# Altium project PCB_Project1.PrjPCB
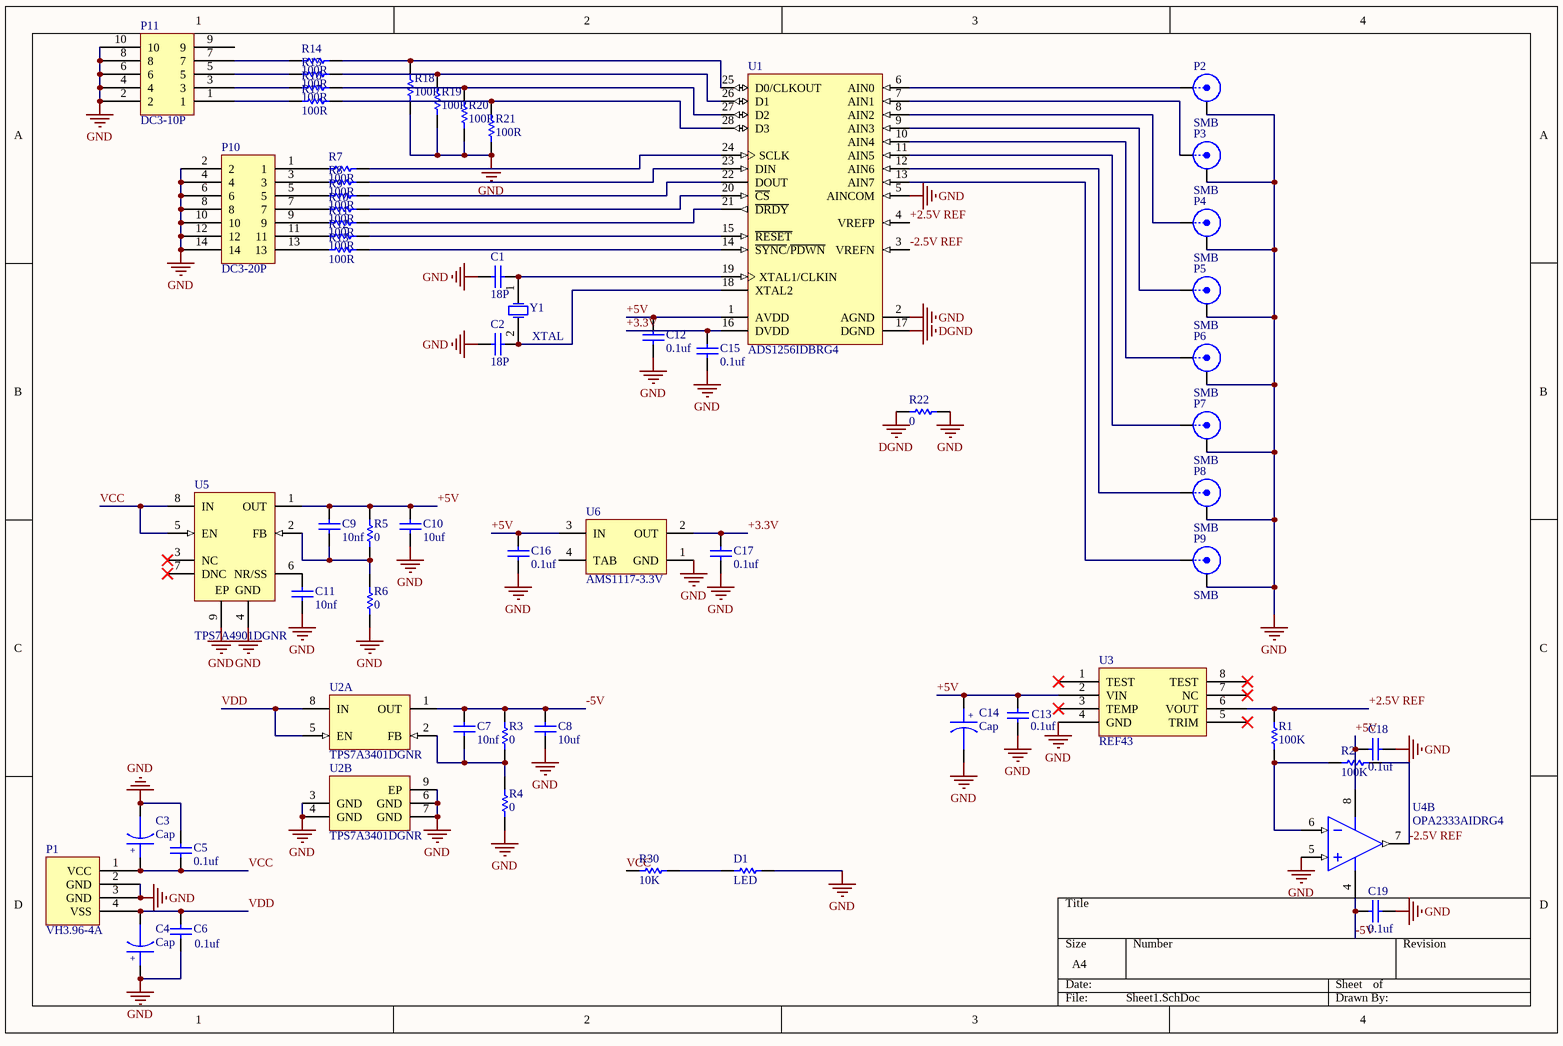
[diagram p0: Sheet1.SchDoc]
1 sheet, 61 parts. Net scope: global (net labels, ports and power ports of the same name join across sheets).
Board file: PCB1.PcbDoc

## Sheet Sheet1.SchDoc
size A4

### Parts
C1  18P  [0603C]
C2  18P  [0603C]
C3  Cap  [7343C-TYPE_D]
C4  Cap  [7343C-TYPE_D]
C5  0.1uf  [0805]
C6  0.1uf  [0805]
C7  10nf  [0805]
C8  10uf  [0805]
C9  10nf  [0805]
C10  10uf  [0805]
C11  10nf  [0805]
C12  0.1uf  [0805]
C13  0.1uf  [0805]
C14  Cap  [3216C-TYPE_A]
C15  0.1uf  [0805]
C16  0.1uf  [0805]
C17  0.1uf  [0805]
C18  0.1uf  [3216C-TYPE_A]
C19  0.1uf  [3216C-TYPE_A]
D1  LED  [0805]
P1  VH3.96-4A  [VH3.96-4P]
P2  SMB  [SMB_V-RJ45]
P3  SMB  [SMB_V-RJ45]
P4  SMB  [SMB_V-RJ45]
P5  SMB  [SMB_V-RJ45]
P6  SMB  [SMB_V-RJ45]
P7  SMB  [SMB_V-RJ45]
P8  SMB  [SMB_V-RJ45]
P9  SMB  [SMB_V-RJ45]
P10  DC3-20P  [DC3-14P]
P11  DC3-10P  [DC3-10P]
R1  100K  [0805]
R2  100K  [0805]
R3  0  [0805]
R4  0  [0805]
R5  0  [0805]
R6  0  [0805]
R7  100R  [0805]
R8  100R  [0805]
R9  100R  [0805]
R10  100R  [0805]
R11  100R  [0805]
R12  100R  [0805]
R13  100R  [0805]
R14  100R  [0805]
R15  100R  [0805]
R16  100R  [0805]
R17  100R  [0805]
R18  100R  [0805]
R19  100R  [0805]
R20  100R  [0805]
R21  100R  [0805]
R22  0  [0805]
R30  10K  [0805]
U1  ADS1256IDBRG4  [TI-DB28_N]
U2  TPS7A3401DGNR  [TI-DGN8-1760X1425TP_N]  (parts A,B of 2)
U3  REF43  [TI-D8_M]
U4  OPA2333AIDRG4  [TI-D8_N]  (part B of 2)
U5  TPS7A4901DGNR  [TI-DGN8-1760X1425TP_N]
U6  AMS1117-3.3V  [SOT-223]
Y1  XTAL  [HC-49S]

### Nets
DGND: R22.1 U1.17(DGND)
GND: C1.1 C2.1 C3.2 C4.1 C5.2 C6.2 C8.1 C10.1 C11.1 C12.1 C13.1 C14.2 C15.1 C16.1 C17.1 C18.2 C19.2 D1.2 P1.2(GND) P1.3(GND) P2.2(Y) P3.2(Y) P4.2(Y) P5.2(Y) P6.2(Y) P7.2(Y) P8.2(Y) P9.2(Y) P10.2 P10.4 P10.6 P10.8 P10.10 P10.12 P10.14 P11.2 P11.4 P11.6 P11.8 P11.10 R4.1 R6.1 R18.1 R19.1 R20.1 R21.1 R22.2 U1.2(AGND) U1.5(AINCOM) U2.3(GND) U2.4(GND) U2.6(GND) U2.7(GND) U2.9(EP) U3.4(GND) U4.5(IN_B+) U5.4(GND) U5.9(EP) U6.1(GND)
+2.5V REF: R1.2 U1.4(VREFP) U3.6(VOUT)
+3.3V: C15.2 C17.2 U1.16(DVDD) U6.2(OUT)
+5V: C9.2 C10.2 C12.2 C13.2 C14.1 C16.2 C18.1 R5.2 U1.1(AVDD) U3.2(VIN) U4.8(V+) U5.1(OUT) U6.3(IN)
-2.5V REF: R2.1 U1.3(VREFN) U4.7(OUT_B)
-5V: C7.2 C8.2 C19.1 R3.2 U2.1(OUT) U4.4(V-)
VCC: C3.1 C5.1 P1.1(VCC) R30.1 U5.5(EN) U5.8(IN)
VDD: C4.2 C6.1 P1.4(VSS) U2.5(EN) U2.8(IN)
NetC1_2: C1.2 U1.19(XTAL1/CLKIN) Y1.1(OSC1)
NetC2_2: C2.2 U1.18(XTAL2) Y1.2(OSC2)
NetC7_1: C7.1 R3.1 R4.2 U2.2(FB)
NetC9_1: C9.1 R5.1 R6.2 U5.2(FB)
NetC11_2: C11.2 U5.6(NR/SS)
NetD1_1: D1.1 R30.2
NetP2_1: P2.1(X) U1.6(AIN0)
NetP3_1: P3.1(X) U1.7(AIN1)
NetP4_1: P4.1(X) U1.8(AIN2)
NetP5_1: P5.1(X) U1.9(AIN3)
NetP6_1: P6.1(X) U1.10(AIN4)
NetP7_1: P7.1(X) U1.11(AIN5)
NetP8_1: P8.1(X) U1.12(AIN6)
NetP9_1: P9.1(X) U1.13(AIN7)
NetP10_1: P10.1 R7.1
NetP10_3: P10.3 R8.1
NetP10_5: P10.5 R9.1
NetP10_7: P10.7 R10.1
NetP10_9: P10.9 R11.1
NetP10_11: P10.11 R12.1
NetP10_13: P10.13 R13.1
NetP11_1: P11.1 R17.1
NetP11_3: P11.3 R16.1
NetP11_5: P11.5 R15.1
NetP11_7: P11.7 R14.1
NetR1_1: R1.1 R2.2 U4.6(IN_B-)
NetR7_2: R7.2 U1.24(SCLK)
NetR8_2: R8.2 U1.23(DIN)
NetR9_2: R9.2 U1.22(DOUT)
NetR10_2: R10.2 U1.20(~{CS})
NetR11_2: R11.2 U1.21(~{DRDY})
NetR12_2: R12.2 U1.15(~{RESET})
NetR13_2: R13.2 U1.14(~{SYNC}/~{PDWN})
NetR14_2: R14.2 R18.2 U1.25(D0/CLKOUT)
NetR15_2: R15.2 R19.2 U1.26(D1)
NetR16_2: R16.2 R20.2 U1.27(D2)
NetR17_2: R17.2 R21.2 U1.28(D3)

Not connected (* = marked no-connect by the designer): P11 9; U3 1(TEST)* 3(TEMP)* 5(TRIM)* 7(NC)* 8(TEST)*; U5 3(NC)* 7(DNC)*; U6 4(TAB)

### Notes on the sheet
- (in symbol Tantalium Cap) +
- (in symbol Cap) +

### Library data of the parts
C1 C2 C5-C13 C15-C19 = Cap
C3 C4 C14 = Tantalium Cap
D1 R1-R22 R30 = Res
P2-P9 = SMB: SMB Straight Connector; LatestRevisionDate: 17-Jul-2002; LatestRevisionNote: Re-released for DXP Platform.; Publisher: Altium Limited
U1 = ADS1256IDBRG4: 24-Bit, 30 kSPS Very Low Noise Delta-Sigma ADC with Multiplexer, -40 to 85 degC, 28-pin SOP (DB28), Green (RoHS & no Sb/Br); Manufacturer: Texas Instruments; # Input Channels: 8; Analog Voltage AV/DD(Max)(V): 5.25; Analog Voltage AV/DD(Min)(V): 4.75; Digital Supply(Max)(V): 3.6; Digital Supply(Min)(V): 1.8; Interface: Serial SPI; Resolution(Bits): 24; Sample Rate (max)(SPS): 30k; SubFamily: Precision ADC (<=10MSPS); DatasheetVersion: SBAS288J; PackageVersion: 4040065/E, 12/2001; PackageReference: DB28; PackageDescription: 28-Pin Plastic Small Outline, Body 10.2 X 5.3 mm, Pitch 0.65 mm; Architecture: Delta-Sigma; Eco-Plan: Green (RoHS & no Sb/Br); Mounting Technology: Surface Mount; Code_JEDEC: MO-150; PartNumber: ADS1256IDBRG4; ComponentLink1Description: Manufacturer URL; ComponentLink1URL: http://www.ti.com/; ComponentLink2Description: Datasheet; ComponentLink2URL: http://www.ti.com/general/docs/lit/getliterature.tsp?genericPartNumber=ADS1256&fileType=pdf; ComponentLink3Description: Package Specification; ComponentLink3URL: http://www.ti.com/lit/ml/msso002e/msso002e.pdf
U2 = TPS7A3401DGNR: Single Output Low Noise LDO, 200 mA, Adjustable -1.18 to -18 V Output, -3 to -20 V Input, 8-pin MSOP (DGN), -40 to 125 degC, Green (RoHS & no Sb/Br); Manufacturer: Texas Instruments; Accuracy(%): 1.5; Iout(Max)(A): 0.2; Iq(Typ)(mA): 0.05; SubFamily: Single Channel LDO; Vdo(Typ)(mV): 216; DatasheetVersion: SBVS163; PackageVersion: 4073271/F; PackageReference: DGN8-1760X1425TP; PackageDescription: 8-pin Plastic Small Outline, Body 3 x 3 mm, Pitch 0.65 mm; Eco-Plan: Green (RoHS & no Sb/Br); Vin(Max)(V): -20; Vin(Min)(V): -3; Vout Adj(Max)(V): -18; Vout Adj(Min)(V): -1.18; Mounting Technology: Surface Mount; Code_JEDEC: MO-187; PartNumber: TPS7A3401DGNR; ComponentLink1Description: Manufacturer URL; ComponentLink1URL: http://www.ti.com/; ComponentLink2Description: Datasheet; ComponentLink2URL: http://www.ti.com/general/docs/lit/getliterature.tsp?genericPartNumber=TPS7A3401&fileType=pdf; ComponentLink3Description: Package Specification; ComponentLink3URL: http://www.ti.com/litv/pdf/mpds046e
U4 = OPA2333AIDRG4: 17 uA, MicroPower, Precision, Zero Drift CMOS Operational Amplifier, 1.8 to 5.5 V, -40 to 125 degC, 8-pin SOIC (D8), Green (RoHS & no Sb/Br); Manufacturer: Texas Instruments; CMRR(Min)(dB): 106; IIB(Max)(pA): 200; Iq per channel(Max)(mA): 0.025; Number of Channels: 2; Offset Drift(Typ)(uV/C): 0.02; Slew Rate(Typ)(V/us): 0.16; Sub Family: Low Offset Voltage Amplifier (<=500uV), Low Power Amp (<=500uA), Low Supply Voltage Amplifier (<=2.7V), Precision Amplifier, Zero Drift Precision Amplifier; Total Supply Voltage(Max)(+5V is 5, +/-5V is 10): 5.5; Total Supply Voltage(Min)(+5V is 5, +/-5V is 10): 1.8; Vio (25C)(Max)(mV): 0.01; DatasheetVersion: SBOS351C; PackageVersion: 4040047-3/M, 06/2011; PackageReference: D8; PackageDescription: 8-Pin Plastic Small Outline, Body 4.9 x 3.9 mm, Pitch 1.27 mm; Eco-Plan: Green (RoHS & no Sb/Br); Mounting Technology: Surface Mount; Code_JEDEC: MS-012; PartNumber: OPA2333AIDRG4; ComponentLink1Description: Manufacturer URL; ComponentLink1URL: http://www.ti.com/; ComponentLink2Description: Datasheet; ComponentLink2URL: http://www.ti.com/general/docs/lit/getliterature.tsp?genericPartNumber=OPA2333&fileType=pdf; ComponentLink3Description: Package Specification; ComponentLink3URL: http://www.ti.com/litv/pdf/msoi002j
U5 = TPS7A4901DGNR: Single Output High PSRR LDO, 150 mA, Adjustable 1.2 to 33 V Output, 3 to 36 V Input, with Ultra-Low Noise, 8-pin MSOP (DGN), -40 to 125 degC, Green (RoHS & no Sb/Br); Manufacturer: Texas Instruments; Accuracy(%): 1.5; Iout(Max)(A): 0.15; Iq(Typ)(mA): 0.06; Power Good: TRUE; SubFamily: Single Channel LDO; Vdo(Typ)(mV): 260; Vin(Max)(V): 36; Vin(Min)(V): 3; Vout Adj(Max)(V): 33; Vout Adj(Min)(V): 1.2; DatasheetVersion: SBVS121B; PackageVersion: 4073271/F; PackageReference: DGN8-1760X1425TP; PackageDescription: 8-pin Plastic Small Outline, Body 3 x 3 mm, Pitch 0.65 mm; Eco-Plan: Green (RoHS & no Sb/Br); Mounting Technology: Surface Mount; Code_JEDEC: MO-187; PartNumber: TPS7A4901DGNR; ComponentLink1Description: Manufacturer URL; ComponentLink1URL: http://www.ti.com/; ComponentLink2Description: Datasheet; ComponentLink2URL: http://www.ti.com/general/docs/lit/getliterature.tsp?genericPartNumber=TPS7A4901&fileType=pdf; ComponentLink3Description: Package Specification; ComponentLink3URL: http://www.ti.com/litv/pdf/mpds046e
Y1 = XTAL: Crystal Oscillator; Published: 8-Jun-2000; LatestRevisionDate: 17-Jul-2002; LatestRevisionNote: Re-released for DXP Platform.; PackageReference: R38; Publisher: Altium Limited; PackageDescription: Crystal, Thru-Hole; 2 Leads; Body 3.1 x 8.2 mm (Dia.xH)